# Altium schematic sheet main.SchDoc
size A4
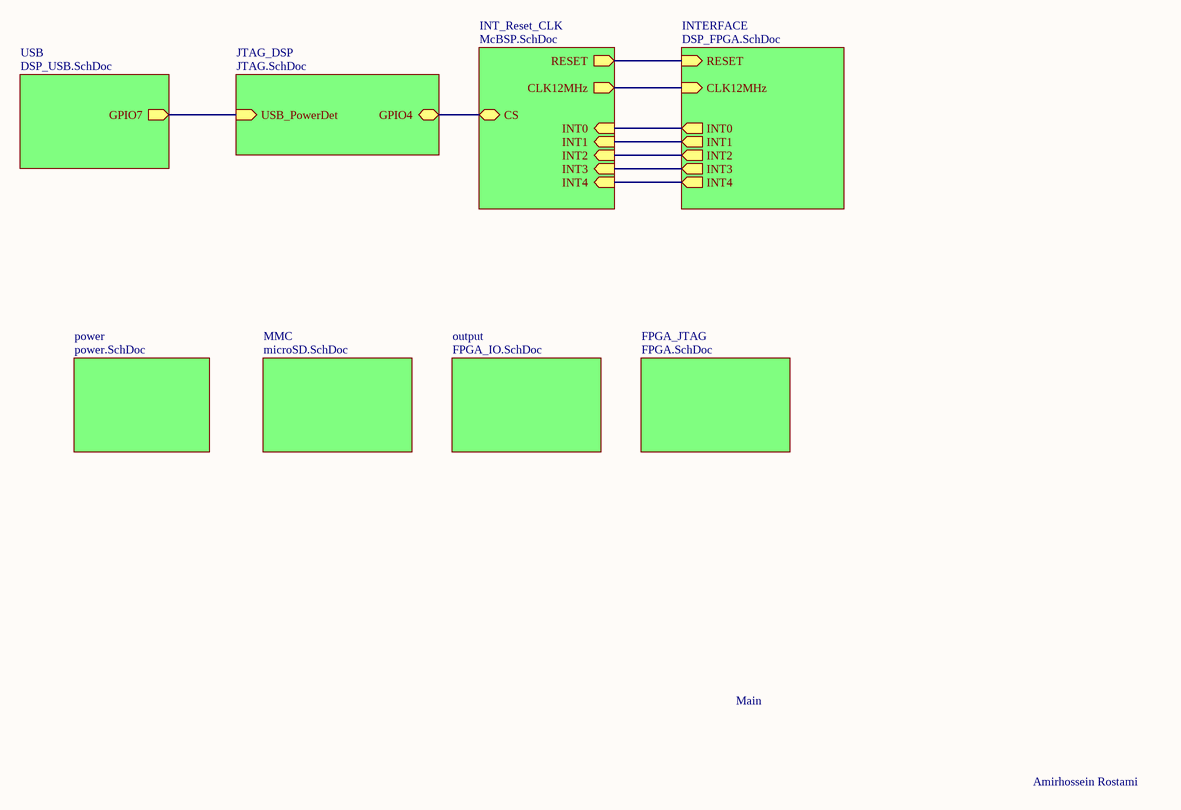
[diagram p0: main.SchDoc]

## Sub-sheets
FPGA_JTAG = FPGA.SchDoc: no entries
INT_Reset_CLK = McBSP.SchDoc: CS, RESET (out), CLK12MHz (out), INT0 (in), INT1 (in), INT2 (in), INT3 (in), INT4 (in)
INTERFACE = DSP_FPGA.SchDoc: RESET (in), CLK12MHz (in), INT0 (out), INT1 (out), INT2 (out), INT3 (out), INT4 (out)
JTAG_DSP = JTAG.SchDoc: GPIO4, USB_PowerDet (in)
MMC = microSD.SchDoc: no entries
output = FPGA_IO.SchDoc: no entries
power = power.SchDoc: no entries
USB = DSP_USB.SchDoc: GPIO7 (out)

## Nets
(unnamed): sheet USB/GPIO7, sheet JTAG_DSP/USB_PowerDet
(unnamed): sheet JTAG_DSP/GPIO4, sheet INT_Reset_CLK/CS
(unnamed): sheet INT_Reset_CLK/RESET, sheet INTERFACE/RESET
(unnamed): sheet INT_Reset_CLK/CLK12MHz, sheet INTERFACE/CLK12MHz
(unnamed): sheet INT_Reset_CLK/INT0, sheet INTERFACE/INT0
(unnamed): sheet INT_Reset_CLK/INT1, sheet INTERFACE/INT1
(unnamed): sheet INT_Reset_CLK/INT2, sheet INTERFACE/INT2
(unnamed): sheet INT_Reset_CLK/INT3, sheet INTERFACE/INT3
(unnamed): sheet INT_Reset_CLK/INT4, sheet INTERFACE/INT4

## Notes on the sheet
- Main
- Amirhossein Rostami